# Altium schematic sheet SH5 - ARMCONTROLS.SchDoc
size Letter; Organization: UW Robotics; Address1: 200 University Avenue; Address2: Waterloo; Address3: Ontario; Address4: Canada N2L 3G6
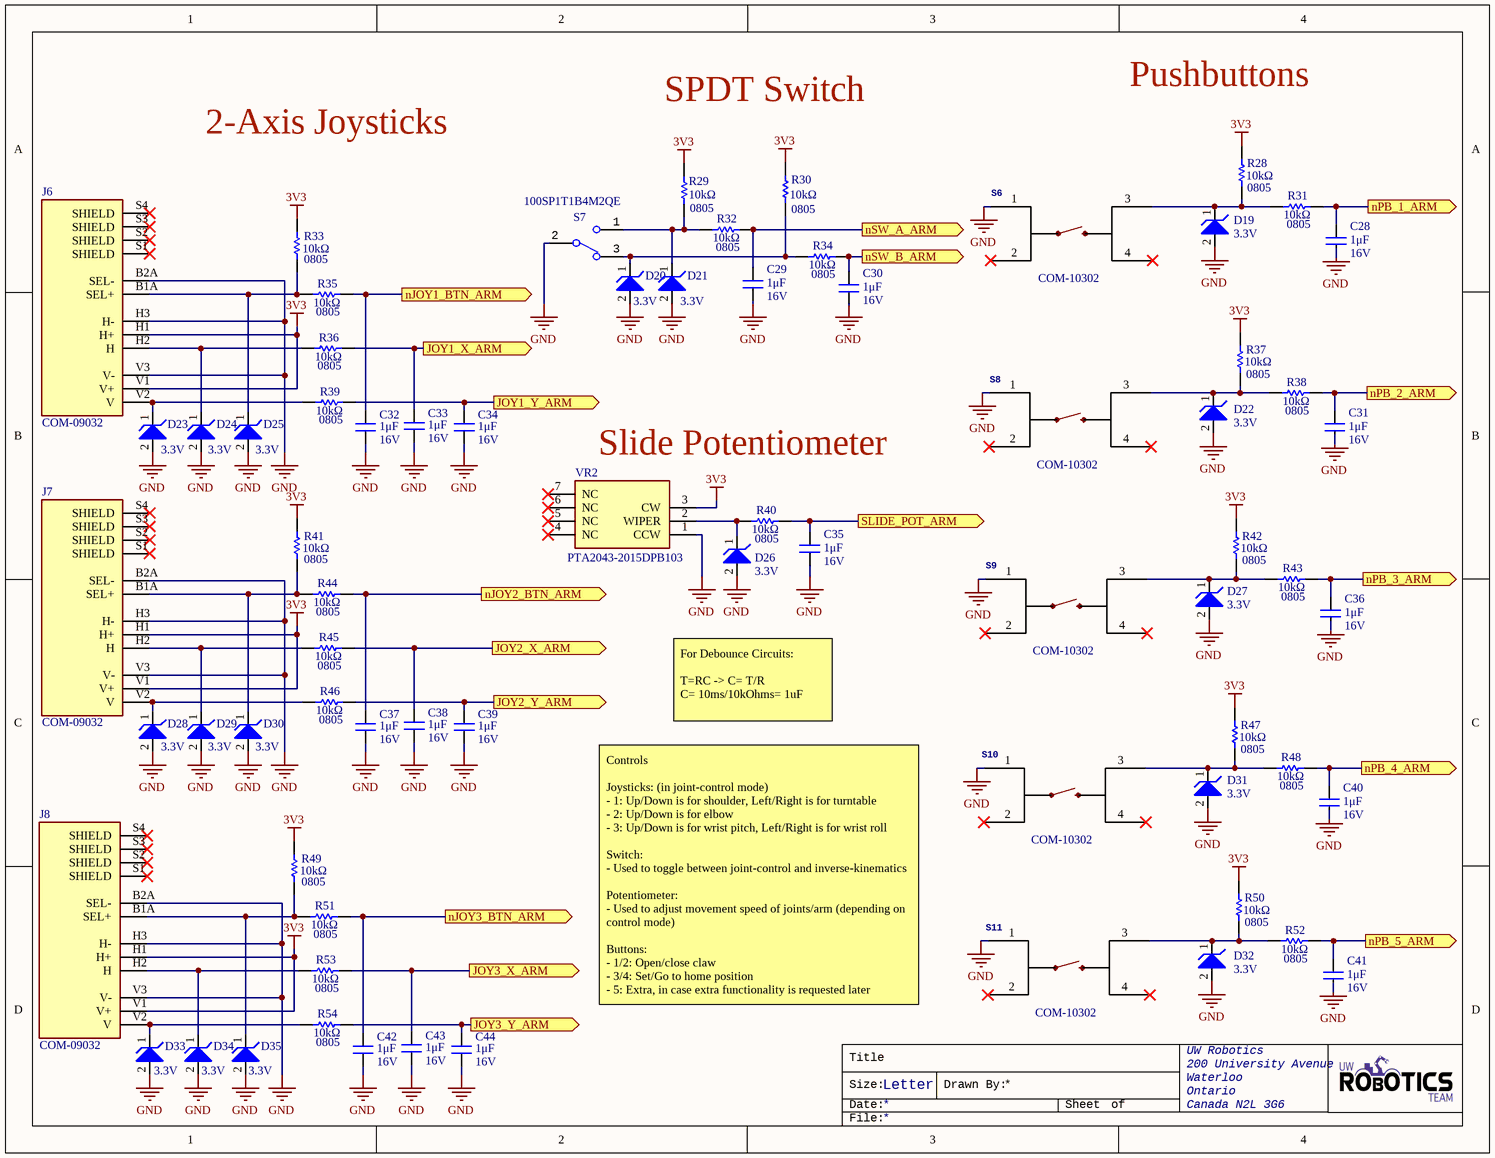
[diagram p0: SH5 - ARMCONTROLS.SchDoc]

## Parts
C28  value 1μF  Voltage Rating: 16V  [CAP2012]  (hidden comment: CAP_1uF_16V_0805)
C29  value 1μF  Voltage Rating: 16V  [CAP2012]  (hidden comment: CAP_1uF_16V_0805)
C30  value 1μF  Voltage Rating: 16V  [CAP2012]  (hidden comment: CAP_1uF_16V_0805)
C31  value 1μF  Voltage Rating: 16V  [CAP2012]  (hidden comment: CAP_1uF_16V_0805)
C32  value 1μF  Voltage Rating: 16V  [CAP2012]  (hidden comment: CAP_1uF_16V_0805)
C33  value 1μF  Voltage Rating: 16V  [CAP2012]  (hidden comment: CAP_1uF_16V_0805)
C34  value 1μF  Voltage Rating: 16V  [CAP2012]  (hidden comment: CAP_1uF_16V_0805)
C35  value 1μF  Voltage Rating: 16V  [CAP2012]  (hidden comment: CAP_1uF_16V_0805)
C36  value 1μF  Voltage Rating: 16V  [CAP2012]  (hidden comment: CAP_1uF_16V_0805)
C37  value 1μF  Voltage Rating: 16V  [CAP2012]  (hidden comment: CAP_1uF_16V_0805)
C38  value 1μF  Voltage Rating: 16V  [CAP2012]  (hidden comment: CAP_1uF_16V_0805)
C39  value 1μF  Voltage Rating: 16V  [CAP2012]  (hidden comment: CAP_1uF_16V_0805)
C40  value 1μF  Voltage Rating: 16V  [CAP2012]  (hidden comment: CAP_1uF_16V_0805)
C41  value 1μF  Voltage Rating: 16V  [CAP2012]  (hidden comment: CAP_1uF_16V_0805)
C42  value 1μF  Voltage Rating: 16V  [CAP2012]  (hidden comment: CAP_1uF_16V_0805)
C43  value 1μF  Voltage Rating: 16V  [CAP2012]  (hidden comment: CAP_1uF_16V_0805)
C44  value 1μF  Voltage Rating: 16V  [CAP2012]  (hidden comment: CAP_1uF_16V_0805)
D19  Reverse Standoff Voltage: 3.3V  [SOD523]  (hidden comment: TVS_DIODE_UNIDIR_3.3V)
D20  Reverse Standoff Voltage: 3.3V  [SOD523]  (hidden comment: TVS_DIODE_UNIDIR_3.3V)
D21  Reverse Standoff Voltage: 3.3V  [SOD523]  (hidden comment: TVS_DIODE_UNIDIR_3.3V)
D22  Reverse Standoff Voltage: 3.3V  [SOD523]  (hidden comment: TVS_DIODE_UNIDIR_3.3V)
D23  Reverse Standoff Voltage: 3.3V  [SOD523]  (hidden comment: TVS_DIODE_UNIDIR_3.3V)
D24  Reverse Standoff Voltage: 3.3V  [SOD523]  (hidden comment: TVS_DIODE_UNIDIR_3.3V)
D25  Reverse Standoff Voltage: 3.3V  [SOD523]  (hidden comment: TVS_DIODE_UNIDIR_3.3V)
D26  Reverse Standoff Voltage: 3.3V  [SOD523]  (hidden comment: TVS_DIODE_UNIDIR_3.3V)
D27  Reverse Standoff Voltage: 3.3V  [SOD523]  (hidden comment: TVS_DIODE_UNIDIR_3.3V)
D28  Reverse Standoff Voltage: 3.3V  [SOD523]  (hidden comment: TVS_DIODE_UNIDIR_3.3V)
D29  Reverse Standoff Voltage: 3.3V  [SOD523]  (hidden comment: TVS_DIODE_UNIDIR_3.3V)
D30  Reverse Standoff Voltage: 3.3V  [SOD523]  (hidden comment: TVS_DIODE_UNIDIR_3.3V)
D31  Reverse Standoff Voltage: 3.3V  [SOD523]  (hidden comment: TVS_DIODE_UNIDIR_3.3V)
D32  Reverse Standoff Voltage: 3.3V  [SOD523]  (hidden comment: TVS_DIODE_UNIDIR_3.3V)
D33  Reverse Standoff Voltage: 3.3V  [SOD523]  (hidden comment: TVS_DIODE_UNIDIR_3.3V)
D34  Reverse Standoff Voltage: 3.3V  [SOD523]  (hidden comment: TVS_DIODE_UNIDIR_3.3V)
D35  Reverse Standoff Voltage: 3.3V  [SOD523]  (hidden comment: TVS_DIODE_UNIDIR_3.3V)
J6  Manufacturer Part Number 1: COM-09032  [2_AXIS_JOYSTICK]  (hidden comment: 2_AXIS_JOYSTICK)
J7  Manufacturer Part Number 1: COM-09032  [2_AXIS_JOYSTICK]  (hidden comment: 2_AXIS_JOYSTICK)
J8  Manufacturer Part Number 1: COM-09032  [2_AXIS_JOYSTICK]  (hidden comment: 2_AXIS_JOYSTICK)
R28  value 10kΩ  Case Code (Imperial): 0805  [RESC0805]  (hidden comment: RES_10kΩ_0805_5%)
R29  value 10kΩ  Case Code (Imperial): 0805  [RESC0805]  (hidden comment: RES_10kΩ_0805_5%)
R30  value 10kΩ  Case Code (Imperial): 0805  [RESC0805]  (hidden comment: RES_10kΩ_0805_5%)
R31  value 10kΩ  Case Code (Imperial): 0805  [RESC0805]  (hidden comment: RES_10kΩ_0805_5%)
R32  value 10kΩ  Case Code (Imperial): 0805  [RESC0805]  (hidden comment: RES_10kΩ_0805_5%)
R33  value 10kΩ  Case Code (Imperial): 0805  [RESC0805]  (hidden comment: RES_10kΩ_0805_5%)
R34  value 10kΩ  Case Code (Imperial): 0805  [RESC0805]  (hidden comment: RES_10kΩ_0805_5%)
R35  value 10kΩ  Case Code (Imperial): 0805  [RESC0805]  (hidden comment: RES_10kΩ_0805_5%)
R36  value 10kΩ  Case Code (Imperial): 0805  [RESC0805]  (hidden comment: RES_10kΩ_0805_5%)
R37  value 10kΩ  Case Code (Imperial): 0805  [RESC0805]  (hidden comment: RES_10kΩ_0805_5%)
R38  value 10kΩ  Case Code (Imperial): 0805  [RESC0805]  (hidden comment: RES_10kΩ_0805_5%)
R39  value 10kΩ  Case Code (Imperial): 0805  [RESC0805]  (hidden comment: RES_10kΩ_0805_5%)
R40  value 10kΩ  Case Code (Imperial): 0805  [RESC0805]  (hidden comment: RES_10kΩ_0805_5%)
R41  value 10kΩ  Case Code (Imperial): 0805  [RESC0805]  (hidden comment: RES_10kΩ_0805_5%)
R42  value 10kΩ  Case Code (Imperial): 0805  [RESC0805]  (hidden comment: RES_10kΩ_0805_5%)
R43  value 10kΩ  Case Code (Imperial): 0805  [RESC0805]  (hidden comment: RES_10kΩ_0805_5%)
R44  value 10kΩ  Case Code (Imperial): 0805  [RESC0805]  (hidden comment: RES_10kΩ_0805_5%)
R45  value 10kΩ  Case Code (Imperial): 0805  [RESC0805]  (hidden comment: RES_10kΩ_0805_5%)
R46  value 10kΩ  Case Code (Imperial): 0805  [RESC0805]  (hidden comment: RES_10kΩ_0805_5%)
R47  value 10kΩ  Case Code (Imperial): 0805  [RESC0805]  (hidden comment: RES_10kΩ_0805_5%)
R48  value 10kΩ  Case Code (Imperial): 0805  [RESC0805]  (hidden comment: RES_10kΩ_0805_5%)
R49  value 10kΩ  Case Code (Imperial): 0805  [RESC0805]  (hidden comment: RES_10kΩ_0805_5%)
R50  value 10kΩ  Case Code (Imperial): 0805  [RESC0805]  (hidden comment: RES_10kΩ_0805_5%)
R51  value 10kΩ  Case Code (Imperial): 0805  [RESC0805]  (hidden comment: RES_10kΩ_0805_5%)
R52  value 10kΩ  Case Code (Imperial): 0805  [RESC0805]  (hidden comment: RES_10kΩ_0805_5%)
R53  value 10kΩ  Case Code (Imperial): 0805  [RESC0805]  (hidden comment: RES_10kΩ_0805_5%)
R54  value 10kΩ  Case Code (Imperial): 0805  [RESC0805]  (hidden comment: RES_10kΩ_0805_5%)
S6  Manufacturer Part Number 1: COM-10302  [TACTILE_SWITCH_PTH_12MM]  (hidden comment: Pushbutton)
S7  100SP1T1B4M2QE  [100SP1T1B4M2QE]
S8  Manufacturer Part Number 1: COM-10302  [TACTILE_SWITCH_PTH_12MM]  (hidden comment: Pushbutton)
S9  Manufacturer Part Number 1: COM-10302  [TACTILE_SWITCH_PTH_12MM]  (hidden comment: Pushbutton)
S10  Manufacturer Part Number 1: COM-10302  [TACTILE_SWITCH_PTH_12MM]  (hidden comment: Pushbutton)
S11  Manufacturer Part Number 1: COM-10302  [TACTILE_SWITCH_PTH_12MM]  (hidden comment: Pushbutton)
VR2  Manufacturer Part Number 1: PTA2043-2015DPB103  [PTA20432015CPB103]  (hidden comment: POT_10K_SLIDE)

## Ports
JOY1_X_ARM (out), JOY1_Y_ARM (out), JOY2_X_ARM (out), JOY2_Y_ARM (out), JOY3_X_ARM (out), JOY3_Y_ARM (out), nJOY1_BTN_ARM (out), nJOY2_BTN_ARM (out), nJOY3_BTN_ARM (out), nPB_1_ARM (out), nPB_2_ARM (out), nPB_3_ARM (out), nPB_4_ARM (out), nPB_5_ARM (out), nSW_A_ARM (out), nSW_B_ARM (out), SLIDE_POT_ARM (out)

## Nets
3V3: J6.H1(H+) J6.V1(V+) J7.H1(H+) J7.V1(V+) J8.H1(H+) J8.V1(V+) R28.1 R29.1 R30.1 R33.1 R37.1 R41.1 R42.1 R47.1 R49.1 R50.1 VR2.3(CW)
GND: C28.1 C29.1 C30.1 C31.1 C32.1 C33.1 C34.1 C35.1 C36.1 C37.1 C38.1 C39.1 C40.1 C41.1 C42.1 C43.1 C44.1 D19.2 D20.2 D21.2 D22.2 D23.2 D24.2 D25.2 D26.2 D27.2 D28.2 D29.2 D30.2 D31.2 D32.2 D33.2 D34.2 D35.2 J6.B2A(SEL-) J6.H3(H-) J6.V3(V-) J7.B2A(SEL-) J7.H3(H-) J7.V3(V-) J8.B2A(SEL-) J8.H3(H-) J8.V3(V-) S6.1 S7.2 S8.1 S9.1 S10.1 S11.1 VR2.1(CCW)
JOY1_X_ARM: C33.2 R36.2 ; port JOY1_X_ARM
JOY1_Y_ARM: C34.2 R39.2 ; port JOY1_Y_ARM
JOY2_X_ARM: C38.2 R45.2 ; port JOY2_X_ARM
JOY2_Y_ARM: C39.2 R46.2 ; port JOY2_Y_ARM
JOY3_X_ARM: C43.2 R53.2 ; port JOY3_X_ARM
JOY3_Y_ARM: C44.2 R54.2 ; port JOY3_Y_ARM
nJOY1_BTN_ARM: C32.2 R35.2 ; port nJOY1_BTN_ARM
nJOY2_BTN_ARM: C37.2 R44.2 ; port nJOY2_BTN_ARM
nJOY3_BTN_ARM: C42.2 R51.2 ; port nJOY3_BTN_ARM
nPB_1_ARM: C28.2 R31.2 ; port nPB_1_ARM
nPB_2_ARM: C31.2 R38.2 ; port nPB_2_ARM
nPB_3_ARM: C36.2 R43.2 ; port nPB_3_ARM
nPB_4_ARM: C40.2 R48.2 ; port nPB_4_ARM
nPB_5_ARM: C41.2 R52.2 ; port nPB_5_ARM
nSW_A_ARM: C29.2 R32.2 ; port nSW_A_ARM
nSW_B_ARM: C30.2 R34.2 ; port nSW_B_ARM
SLIDE_POT_ARM: C35.2 R40.2 ; port SLIDE_POT_ARM
NetD19_1: D19.1 R28.2 R31.1 S6.3
NetD20_1: D20.1 R30.2 R34.1 S7.3
NetD21_1: D21.1 R29.2 R32.1 S7.1
NetD22_1: D22.1 R37.2 R38.1 S8.3
NetD23_1: D23.1 J6.V2(V) R39.1
NetD24_1: D24.1 J6.H2(H) R36.1
NetD25_1: D25.1 J6.B1A(SEL+) R33.2 R35.1
NetD26_1: D26.1 R40.1 VR2.2(WIPER)
NetD27_1: D27.1 R42.2 R43.1 S9.3
NetD28_1: D28.1 J7.V2(V) R46.1
NetD29_1: D29.1 J7.H2(H) R45.1
NetD30_1: D30.1 J7.B1A(SEL+) R41.2 R44.1
NetD31_1: D31.1 R47.2 R48.1 S10.3
NetD32_1: D32.1 R50.2 R52.1 S11.3
NetD33_1: D33.1 J8.V2(V) R54.1
NetD34_1: D34.1 J8.H2(H) R53.1
NetD35_1: D35.1 J8.B1A(SEL+) R49.2 R51.1

Not connected (* = marked no-connect by the designer): J6 S1(SHIELD)* S2(SHIELD)* S3(SHIELD)* S4(SHIELD)*; J7 S1(SHIELD)* S2(SHIELD)* S3(SHIELD)* S4(SHIELD)*; J8 S1(SHIELD)* S2(SHIELD)* S3(SHIELD)* S4(SHIELD)*; S6 2* 4*; S8 2* 4*; S9 2* 4*; S10 2* 4*; S11 2* 4*; VR2 4(NC)* 5(NC)* 6(NC)* 7(NC)*

## Notes on the sheet
- Pushbuttons
- 2-Axis Joysticks
- SPDT Switch
- (near VR2) Slide Potentiometer
- For Debounce Circuits:
  T=RC -> C= T/R
  C= 10ms/10kOhms= 1uF
- Controls
  Joysticks: (in joint-control mode)
  - 1: Up/Down is for shoulder, Left/Right is for turntable
  - 2: Up/Down is for elbow
  - 3: Up/Down is for wrist pitch, Left/Right is for wrist roll
  Switch:
  - Used to toggle between joint-control and inverse-kinematics
  Potentiometer:
  - Used to adjust movement speed of joints/arm (depending on control mode)
  Buttons:
  - 1/2: Open/close claw
  - 3/4: Set/Go to home position
  - 5: Extra, in case extra functionality is requested later
- Title
- Size:
- Date:
- Letter
- Drawn By:
- Sheet
- of
- File:

## Library data of the parts
C28-C44 = CAP_1uF_16V_0805: CAP CER 1UF 16V X7R 0805; Manufacturer 1: Yageo; Manufacturer Part Number 1: CC0805KKX7R7BB105; Tolerance: 10%; Mount: Surface Mount; Case Code (Metric): 2012; Case Code (Imperial): 0805; Min Operating Temperature: -55°C; Max Operating Temperature: 125°C; Dielectric: X7R; Termination: SMD/SMT; Supplier 1: Digi-Key; Supplier Part Number 1: 311-1365-1-ND; Package: 0805 (2012 Metric)
D19-D35 = TVS_DIODE_UNIDIR_3.3V: TVS DIODE 3.3V 14.1V SOD523. Used to protect each connector input line going into the MCU.; Manufacturer 1: ON Semiconductor; Manufacturer Part Number 1: ESD5Z3.3T1G; Reverse Breakdown Voltage: 5V; Peak Pulse Power: 158W; Power Line Protection: No; Number of Channels: 1; Polarity: Unidirectional; Peak Pulse Current: 11.2A; Supplier 1: Digi-Key; Mount: Surface Mount; Number of Pins: 2; Min Operating Temperature: -55°C; Max Operating Temperature: 150°C; Clamping Voltage: 14.1V; Composition: Zener; Supplier Part Number 1: ESD5Z3.3T1GOSCT-ND
J6-J8 = 2_AXIS_JOYSTICK: JOYSTICK 10K OHM 2 AXIS TH; Manufacturer 1: SparkFun; Supplier 1: Digi-Key; Supplier Part Number 1: 1568-1526-ND
R28-R54 = RES_10kΩ_0805_5%: RES 10K OHM 5% 1/8W 0805; Manufacturer 1: Panasonic Electronic Components; Manufacturer Part Number 1: ERJ-6GEYJ103V; Supplier 1: Digi-Key; Supplier Part Number 1: P10KACT-ND
S6 S8-S11 = MOMENTARY_SWITCH_TH: TACTILE MOMENTARY PUSHBUTTON SPST; Manufacturer 1: SparkFun; SymbolName_1: SWITCH-MOMENTARY-2; PROD_ID: SWCH-09185; SF_SKU: COM-09190; Package: TACTILE_SWITCH_PTH_12MM; Supplier 1: Digi-Key; Mount: Through Hole; Throw Configuration: SPST; Termination: PC Pin; Supplier Part Number 1: 1568-1332-ND
S7 = SW_SPDT: SWITCH TOGGLE SPDT 5A 120V; Manufacturer 1: E-Switch; Actuator Material: Brass,Chrome; Switch Function: On-On; Voltage Rating (DC): 28V; Illumination Type: Non-Illuminated,Illuminated; Actuator Type: Standard Round; Electrical Life: 40000Cycles; Actuator Length: 12.19mm; Supplier 1: Digi-Key; Manufacturer Part Number 1: 100SP1T1B4M2QE; Mount: Through Hole; Contact Material: Silver; Contact Plating: Silver; Min Operating Temperature: -30°C; Max Operating Temperature: 85°C; Current Rating: 5A; Voltage Rating (AC): 120V; Orientation: Vertical; Termination: PC Pin; Throw Configuration: SPDT; Supplier Part Number 1: EG2355-ND
VR2 = POT_10K_SLIDE: SLIDE POT 10K OHM 0.1W TOP 20MM; Manufacturer 1: Bourns; Max Power Dissipation: 100mW; Tolerance: 20%; Resistance: 10kR; Power Rating: 50mW; Number of Turns: 1; Hole Diameter: 1.2mm; Supplier 1: Digi-Key; Stock 1: 927; Pricing 1: 1=1.29000, 10=1.14000, 25=1.02600, 50=0.98800, 100=0.95000, 250=0.89300, 500=0.76000, 1000=0.70300, 5000=0.57760 (USD); RoHS: Yes; Mount: Through Hole; Min Operating Temperature: -10°C; Max Operating Temperature: 50°C; Packaging: Bulk; Composition: Potentiometer; Type: Potentiometer; Termination: Pin; Taper: Linear; Military Standard: Not; Package Quantity: 100; Length: 35mm; Height: 0.256inch; Width: 0.354inch; Depth: 9mm; ComponentLink1URL: https://datasheet.ciiva.com/6248/pta-6248511.pdf?src-supplier=Digi-Key; ComponentLink1Description: https://datasheet.ciiva.com/6248/pta-6248511.pdf?src-supplier=Digi-Key; Supplier Part Number 1: PTA2043-2015DPB103-ND; Radiation Hardening: No